# EAGLE schematic schema_mpb_1_1_Serial (EAGLE 9.0.1)
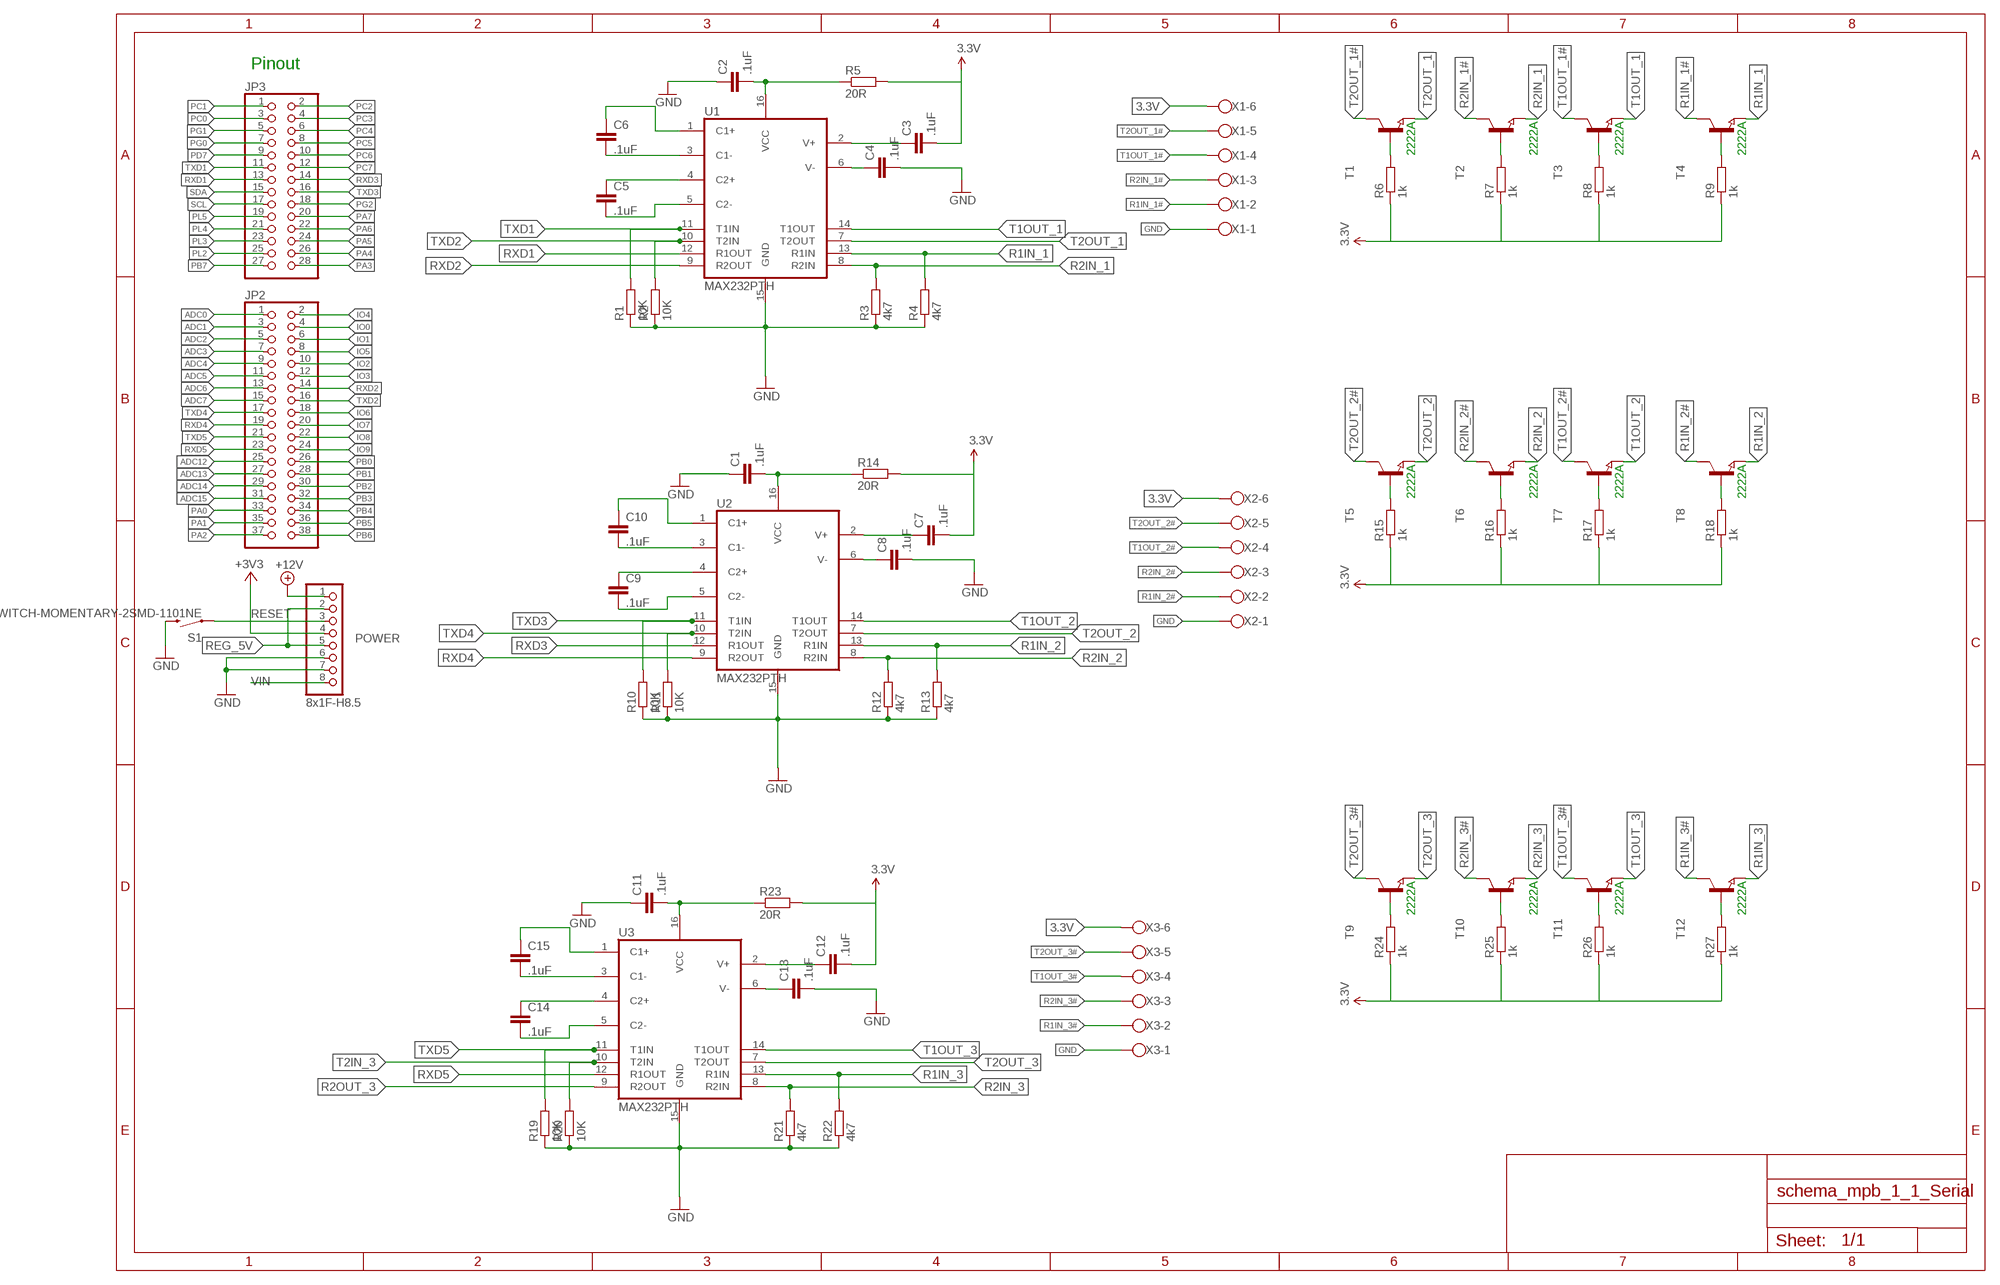
[diagram p0: schematic, sheet 1]

## Parts
C1  .1uF  C-EUC0805  [C0805]
C2  .1uF  C-EUC0805  [C0805]
C3  .1uF  C-EUC0805  [C0805]
C4  .1uF  C-EUC0805  [C0805]
C5  .1uF  C-EUC0805  [C0805]
C6  .1uF  C-EUC0805  [C0805]
C7  .1uF  C-EUC0805  [C0805]
C8  .1uF  C-EUC0805  [C0805]
C9  .1uF  C-EUC0805  [C0805]
C10  .1uF  C-EUC0805  [C0805]
C11  .1uF  C-EUC0805  [C0805]
C12  .1uF  C-EUC0805  [C0805]
C13  .1uF  C-EUC0805  [C0805]
C14  .1uF  C-EUC0805  [C0805]
C15  .1uF  C-EUC0805  [C0805]
JP2  PINHD-2X19  [2X19]
JP3  PINHD-2X14  [2X14]
POWER  8x1F-H8.5  PINHD-1X8  [1X08]
R1  10K  R-EU_R0805  [R0805]
R2  10K  R-EU_R0805  [R0805]
R3  4k7  R-EU_R0805  [R0805]
R4  4k7  R-EU_R0805  [R0805]
R5  20R  R-EU_R0805  [R0805]
R6  1k  R-EU_R0805  [R0805]
R7  1k  R-EU_R0805  [R0805]
R8  1k  R-EU_R0805  [R0805]
R9  1k  R-EU_R0805  [R0805]
R10  10K  R-EU_R0805  [R0805]
R11  10K  R-EU_R0805  [R0805]
R12  4k7  R-EU_R0805  [R0805]
R13  4k7  R-EU_R0805  [R0805]
R14  20R  R-EU_R0805  [R0805]
R15  1k  R-EU_R0805  [R0805]
R16  1k  R-EU_R0805  [R0805]
R17  1k  R-EU_R0805  [R0805]
R18  1k  R-EU_R0805  [R0805]
R19  10K  R-EU_R0805  [R0805]
R20  10K  R-EU_R0805  [R0805]
R21  4k7  R-EU_R0805  [R0805]
R22  4k7  R-EU_R0805  [R0805]
R23  20R  R-EU_R0805  [R0805]
R24  1k  R-EU_R0805  [R0805]
R25  1k  R-EU_R0805  [R0805]
R26  1k  R-EU_R0805  [R0805]
R27  1k  R-EU_R0805  [R0805]
S1  SWITCH-MOMENTARY-2SMD-1101NE  [TACTILE-SWITCH-1101NE]
T1  NPN-TRANSISTOR_SOT23  [SOT23]
T2  NPN-TRANSISTOR_SOT23  [SOT23]
T3  NPN-TRANSISTOR_SOT23  [SOT23]
T4  NPN-TRANSISTOR_SOT23  [SOT23]
T5  NPN-TRANSISTOR_SOT23  [SOT23]
T6  NPN-TRANSISTOR_SOT23  [SOT23]
T7  NPN-TRANSISTOR_SOT23  [SOT23]
T8  NPN-TRANSISTOR_SOT23  [SOT23]
T9  NPN-TRANSISTOR_SOT23  [SOT23]
T10  NPN-TRANSISTOR_SOT23  [SOT23]
T11  NPN-TRANSISTOR_SOT23  [SOT23]
T12  NPN-TRANSISTOR_SOT23  [SOT23]
U1  MAX232PTH  [DIL16]
U2  MAX232PTH  [DIL16]
U3  MAX232PTH  [DIL16]
X1  W237-6  [W237-6]
X2  W237-6  [W237-6]
X3  W237-6  [W237-6]

## Nets
3.3V: C3.2 C7.2 C12.2 POWER.4 R5.2 R6.1 R7.1 R8.1 R9.1 R14.2 R15.1 R16.1 R17.1 R18.1 R23.2 R24.1 R25.1 R26.1 R27.1 X1.6 X2.6 X3.6 ; supply symbol labelled +3V3
+12V: POWER.1
ADC0: JP2.1
ADC1: JP2.3
ADC2: JP2.5
ADC3: JP2.7
ADC4: JP2.9
ADC5: JP2.11
ADC6: JP2.13
ADC7: JP2.15
ADC12: JP2.25
ADC13: JP2.27
ADC14: JP2.29
ADC15: JP2.31
GND [gnd]: C1.1 C2.1 C4.2 C8.2 C11.1 C13.2 POWER.6 POWER.7 R1.1 R2.1 R3.1 R4.1 R10.1 R11.1 R12.1 R13.1 R19.1 R20.1 R21.1 R22.1 S1.2 U1.15(GND) U2.15(GND) U3.15(GND) X1.1 X2.1 X3.1
IO0: JP2.4
IO1: JP2.6
IO2: JP2.10
IO3: JP2.12
IO4: JP2.2
IO5: JP2.8
IO6: JP2.18
IO7: JP2.20
IO8: JP2.22
IO9: JP2.24
N$1: C10.2 U2.3(C1-)
N$2: C10.1 U2.1(C1+)
N$3: C9.2 U2.5(C2-)
N$4: C9.1 U2.4(C2+)
N$5: C8.1 U2.6(V-)
N$6: C1.2 R14.1 U2.16(VCC)
N$7: C7.1 U2.2(V+)
N$8: R15.2 T5.1(B)
N$9: R16.2 T6.1(B)
N$10: R17.2 T7.1(B)
N$11: R18.2 T8.1(B)
N$12: C15.2 U3.3(C1-)
N$13: C15.1 U3.1(C1+)
N$14: C14.2 U3.5(C2-)
N$15: C6.2 U1.3(C1-)
N$16: C6.1 U1.1(C1+)
N$17: C5.2 U1.5(C2-)
N$18: C5.1 U1.4(C2+)
N$19: C4.1 U1.6(V-)
N$20: C2.2 R5.1 U1.16(VCC)
N$21: C3.1 U1.2(V+)
N$22: R6.2 T1.1(B)
N$23: R7.2 T2.1(B)
N$24: R8.2 T3.1(B)
N$25: R9.2 T4.1(B)
N$26: C14.1 U3.4(C2+)
N$27: C13.1 U3.6(V-)
N$28: C11.2 R23.1 U3.16(VCC)
N$29: C12.1 U3.2(V+)
N$30: R24.2 T9.1(B)
N$31: R25.2 T10.1(B)
N$32: R26.2 T11.1(B)
N$33: R27.2 T12.1(B)
PA0: JP2.33
PA1: JP2.35
PA2: JP2.37
PA3: JP3.28
PA4: JP3.26
PA5: JP3.24
PA6: JP3.22
PA7: JP3.20
PB0: JP2.26
PB1: JP2.28
PB2: JP2.30
PB3: JP2.32
PB4: JP2.34
PB5: JP2.36
PB6: JP2.38
PB7: JP3.27
PC0: JP3.3
PC1: JP3.1
PC2: JP3.2
PC3: JP3.4
PC4: JP3.6
PC5: JP3.8
PC6: JP3.10
PC7: JP3.12
PD7: JP3.9
PG0: JP3.7
PG1: JP3.5
PG2: JP3.18
PL2: JP3.25
PL3: JP3.23
PL4: JP3.21
PL5: JP3.19
R1IN_1: R4.2 T4.2(E) U1.13(R1IN)
R1IN_1#: T4.3(C) X1.2
R1IN_2: R13.2 T8.2(E) U2.13(R1IN)
R1IN_2#: T8.3(C) X2.2
R1IN_3: R22.2 T12.2(E) U3.13(R1IN)
R1IN_3#: T12.3(C) X3.2
R2IN_1: R3.2 T2.2(E) U1.8(R2IN)
R2IN_1#: T2.3(C) X1.3
R2IN_2: R12.2 T6.2(E) U2.8(R2IN)
R2IN_2#: T6.3(C) X2.3
R2IN_3: R21.2 T10.2(E) U3.8(R2IN)
R2IN_3#: T10.3(C) X3.3
R2OUT_3: U3.9(R2OUT)
REG_5V: POWER.2 POWER.5
RESET: POWER.3 S1.1
RXD1: JP3.13 U1.12(R1OUT)
RXD2: JP2.14 U1.9(R2OUT)
RXD3: JP3.14 U2.12(R1OUT)
RXD4: JP2.19 U2.9(R2OUT)
RXD5: JP2.23 U3.12(R1OUT)
SCL: JP3.17
SDA: JP3.15
T1OUT_1: T3.2(E) U1.14(T1OUT)
T1OUT_1#: T3.3(C) X1.4
T1OUT_2: T7.2(E) U2.14(T1OUT)
T1OUT_2#: T7.3(C) X2.4
T1OUT_3: T11.2(E) U3.14(T1OUT)
T1OUT_3#: T11.3(C) X3.4
T2IN_3: R20.2 U3.10(T2IN)
T2OUT_1: T1.2(E) U1.7(T2OUT)
T2OUT_1#: T1.3(C) X1.5
T2OUT_2: T5.2(E) U2.7(T2OUT)
T2OUT_2#: T5.3(C) X2.5
T2OUT_3: T9.2(E) U3.7(T2OUT)
T2OUT_3#: T9.3(C) X3.5
TXD1: JP3.11 R1.2 U1.11(T1IN)
TXD2: JP2.16 R2.2 U1.10(T2IN)
TXD3: JP3.16 R10.2 U2.11(T1IN)
TXD4: JP2.17 R11.2 U2.10(T2IN)
TXD5: JP2.21 R19.2 U3.11(T1IN)
VIN [power]: POWER.8

## Notes on the sheet
- Pinout
- 2222A | 2222A | 2222A | 2222A
- 2222A | 2222A | 2222A | 2222A
- 2222A | 2222A | 2222A | 2222A

## Library data of the parts
C1-C15 = rcl:C-EU: CAPACITOR, European symbol; SPICEPREFIX: C
JP2 = pinhead:PINHD-2X19: PIN HEADER
JP3 = pinhead:PINHD-2X14: PIN HEADER
POWER = SmartPrj:PINHD-1X8: PIN HEADER
R1-R27 = rcl:R-EU_: RESISTOR, European symbol; SPICEPREFIX: R
S1 = SparkFun-Electromechanical:SWITCH-MOMENTARY-2: Various NO switches- pushbuttons, reed, etc; PROD_ID: SWCH-00815
T1-T12 = semicon-smd-ipc:NPN-TRANSISTOR_: NPN TRANSISTOR
U1-U3 = SparkFun-DigitalIC:MAX232: RS232 Transceiver Very common IC. This is generically called 'MAX232', but works with the 3V equivalent MAX3232 generic ICs. Field tested and mother approved. Spark Fun Electronics SKU : COM-00316 (DIP) and COM-00589 (SMD)
X1-X3 = con-wago-500:W237-6: WAGO SCREW CLAMP; OC_FARNELL: unknown; OC_NEWARK: unknown

## Net classes
1 power: width 0.152 mm, drill 0.152 mm, clearance 0.152 mm
2 gnd: width 0.152 mm, drill 0.152 mm, clearance 0.152 mm